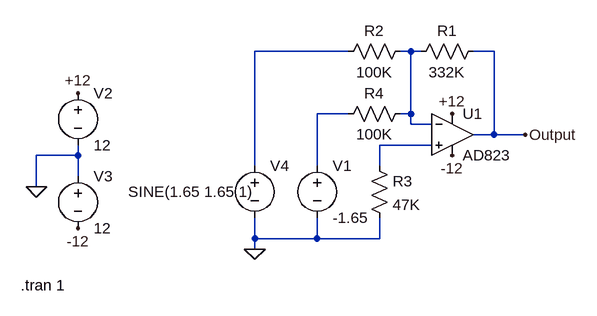
[diagram p0: schematic output.asc]
output.asc, the LTspice schematic file:
Version 4
SHEET 1 880 680
WIRE 112 48 -32 48
WIRE 208 48 192 48
WIRE 224 48 208 48
WIRE 336 48 304 48
WIRE 112 144 64 144
WIRE 208 144 208 48
WIRE 208 144 192 144
WIRE 208 160 208 144
WIRE 240 160 208 160
WIRE 336 176 336 48
WIRE 336 176 304 176
WIRE 384 176 336 176
WIRE 240 192 160 192
WIRE -304 208 -304 192
WIRE -304 208 -368 208
WIRE -32 224 -32 48
WIRE 64 224 64 144
WIRE 160 224 160 192
WIRE -304 240 -304 208
WIRE -368 256 -368 208
WIRE -32 336 -32 304
WIRE 64 336 64 304
WIRE 64 336 -32 336
WIRE 160 336 160 304
WIRE 160 336 64 336
WIRE -32 352 -32 336
FLAG -368 256 0
FLAG -304 320 -12
FLAG -304 112 +12
FLAG 272 144 +12
FLAG 272 208 -12
FLAG -32 352 0
FLAG 384 176 Output
SYMBOL OpAmps\\AD823 272 112 R0
SYMATTR InstName U1
SYMBOL voltage 64 208 R0
WINDOW 123 0 0 Left 0
WINDOW 39 0 0 Left 0
SYMATTR InstName V1
SYMATTR Value -1.65
SYMBOL voltage -304 96 R0
WINDOW 123 0 0 Left 0
WINDOW 39 0 0 Left 0
SYMATTR InstName V2
SYMATTR Value 12
SYMBOL voltage -304 224 R0
WINDOW 123 0 0 Left 0
WINDOW 39 0 0 Left 0
SYMATTR InstName V3
SYMATTR Value 12
SYMBOL voltage -32 208 R0
WINDOW 3 -195 56 Left 2
WINDOW 123 0 0 Left 0
WINDOW 39 0 0 Left 0
SYMATTR Value SINE(1.65 1.65 1)
SYMATTR InstName V4
SYMBOL res 320 32 R90
WINDOW 0 0 56 VBottom 2
WINDOW 3 32 56 VTop 2
SYMATTR InstName R1
SYMATTR Value 332K
SYMBOL res 208 32 R90
WINDOW 0 0 56 VBottom 2
WINDOW 3 32 56 VTop 2
SYMATTR InstName R2
SYMATTR Value 100K
SYMBOL res 144 208 R0
SYMATTR InstName R3
SYMATTR Value 47K
SYMBOL res 208 128 R90
WINDOW 0 0 56 VBottom 2
WINDOW 3 32 56 VTop 2
SYMATTR InstName R4
SYMATTR Value 100K
TEXT -392 408 Left 2 !.tran 1

The netlist it stands for:
* output.asc
XU1 N004 N002 +12 -12 Output AD823  ; pins In+ In- V+ V- OUT
V1 N003 0 -1.65
V2 +12 0 12
V3 0 -12 12
V4 N001 0 SINE(1.65 1.65 1)
R1 Output N002 332K
R2 N002 N001 100K
R3 N004 0 47K
R4 N002 N003 100K
.tran 1
.lib ADI.lib
.backanno
.end